# EAGLE design PowerTXBoard (EAGLE 7.5.0)
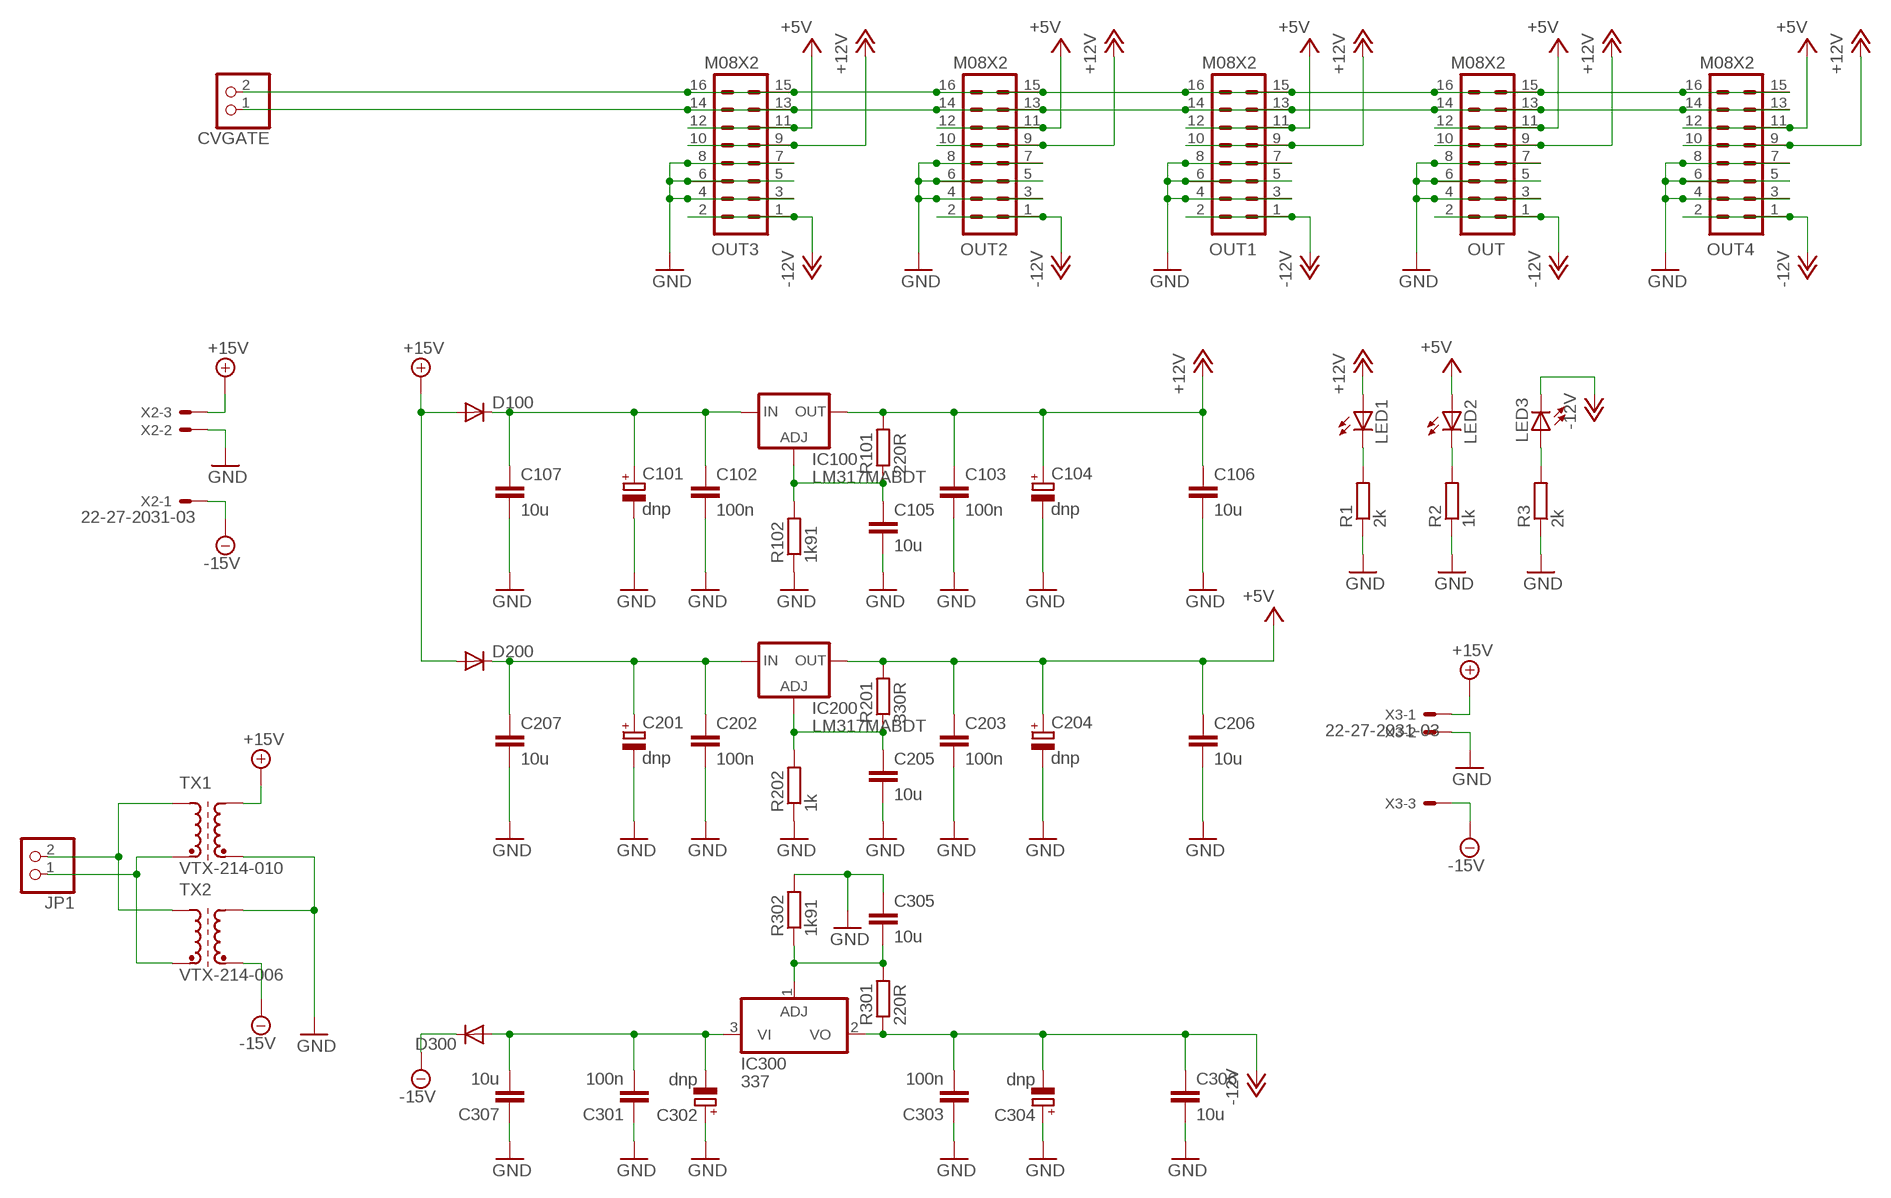
[diagram p0: schematic, sheet 1]

## Parts
C101  dnp  CPOL-EU153CLV-0505  [CPOL-5]
C102  100n  C-EUC0603  [C0603]
C103  100n  C-EUC0603  [C0603]
C104  dnp  CPOL-EU153CLV-0505  [CPOL-5]
C105  10u  C-EUC1206  [C1206]
C106  10u  C-EUC1206  [C1206]
C107  10u  C-EUC1206  [C1206]
C201  dnp  CPOL-EU153CLV-0505  [CPOL-5]
C202  100n  C-EUC0603  [C0603]
C203  100n  C-EUC0603  [C0603]
C204  dnp  CPOL-EU153CLV-0505  [CPOL-5]
C205  10u  C-EUC1206  [C1206]
C206  10u  C-EUC1206  [C1206]
C207  10u  C-EUC1206  [C1206]
C301  100n  C-EUC0603  [C0603]
C302  dnp  CPOL-EU153CLV-0505  [CPOL-5]
C303  100n  C-EUC0603  [C0603]
C304  dnp  CPOL-EU153CLV-0505  [CPOL-5]
C305  10u  C-EUC1206  [C1206]
C306  10u  C-EUC1206  [C1206]
C307  10u  C-EUC1206  [C1206]
CVGATE  PINHD-1X2  [1X02]
D100  DIODESMA  [SMA-DIODE]
D200  DIODESMA  [SMA-DIODE]
D300  DIODESMA  [SMA-DIODE]
IC100  LM317MABDT  [DPACK]
IC200  LM317MABDT  [DPACK]
IC300  337  [TO252]
JP1  PINHD-1X2  [1X02]
LED1  LEDCHIPLED_1206  [CHIPLED_1206]
LED2  LEDCHIPLED_1206  [CHIPLED_1206]
LED3  LEDCHIPLED_1206  [CHIPLED_1206]
OUT  M08X2  [2X8]
OUT1  M08X2  [2X8]
OUT2  M08X2  [2X8]
OUT3  M08X2  [2X8]
OUT4  M08X2  [2X8]
R1  2k  R-EU_0603  [0603]
R2  1k  R-EU_0603  [0603]
R3  2k  R-EU_0603  [0603]
R101  220R  R-EU_0603  [0603]
R102  1k91  R-EU_0603  [0603]
R201  330R  R-EU_0603  [0603]
R202  1k  R-EU_0603  [0603]
R301  220R  R-EU_0603  [0603]
R302  1k91  R-EU_0603  [0603]
TX1  VTX-214-010  VTX-214-006  [VTX-214-006]
TX2  VTX-214-006  [VTX-214-006]
X2  22-27-2031-03  [6410-03]
X3  22-27-2031-03  [6410-03]

## Nets
+5V: C203.1 C204.+ C206.1 IC200.4(OUT) LED2.A OUT1.11 OUT1.12 OUT2.11 OUT2.12 OUT3.11 OUT3.12 OUT4.11 OUT4.12 OUT.11 OUT.12 R201.2
+12V: C103.1 C104.+ C106.1 IC100.4(OUT) LED1.A OUT1.9 OUT1.10 OUT2.9 OUT2.10 OUT3.9 OUT3.10 OUT4.9 OUT4.10 OUT.9 OUT.10 R101.2
+15V: D100.A D200.A TX1.P$3(A2) X2.3 X3.1
-12V: C303.2 C304.- C306.1 IC300.2(VO) LED3.C OUT1.1 OUT1.2 OUT2.1 OUT2.2 OUT3.1 OUT3.2 OUT4.1 OUT4.2 OUT.1 OUT.2 R301.1
-15V: D300.C TX2.P$4(E2) X2.1 X3.3
GND: C101.- C102.2 C103.2 C104.- C105.2 C106.2 C107.2 C201.- C202.2 C203.2 C204.- C205.2 C206.2 C207.2 C301.1 C302.+ C303.1 C304.+ C305.1 C306.2 C307.1 OUT1.3 OUT1.4 OUT1.5 OUT1.6 OUT1.7 OUT1.8 OUT2.3 OUT2.4 OUT2.5 OUT2.6 OUT2.7 OUT2.8 OUT3.3 OUT3.4 OUT3.5 OUT3.6 OUT3.7 OUT3.8 OUT4.3 OUT4.4 OUT4.5 OUT4.6 OUT4.7 OUT4.8 OUT.3 OUT.4 OUT.5 OUT.6 OUT.7 OUT.8 R1.1 R2.1 R3.1 R102.1 R202.1 R302.2 TX1.P$4(E2) TX2.P$3(A2) X2.2 X3.2
N$1: LED1.C R1.2
N$2: LED2.C R2.2
N$3: C105.1 IC100.1(ADJ) R101.1 R102.2
N$4: C205.1 IC200.1(ADJ) R201.1 R202.2
N$5: C305.2 IC300.1(ADJ) R301.2 R302.1
N$6: C301.2 C302.- C307.2 D300.A IC300.3(VI)
N$7: C201.+ C202.1 C207.1 D200.C IC200.3(IN)
N$8: C101.+ C102.1 C107.1 D100.C IC100.3(IN)
N$9: LED3.A R3.2
N$10: CVGATE.1 OUT1.13 OUT1.14 OUT2.13 OUT2.14 OUT3.13 OUT3.14 OUT4.13 OUT4.14 OUT.13 OUT.14
N$11: JP1.2 TX1.P$1(A1) TX2.P$1(A1)
N$12: CVGATE.2 OUT1.15 OUT1.16 OUT2.15 OUT2.16 OUT3.15 OUT3.16 OUT4.15 OUT4.16 OUT.15 OUT.16
N$13: JP1.1 TX1.P$2(E1) TX2.P$2(E1)

## Library data of the parts
C101 C104 C201 C204 C302 C304 = Rebel:CPOL-EU: POLARIZED CAPACITOR, European symbol
C102 C103 C105-C107 C202 C203 C205-C207 C301 C303 C305-C307 = rcl:C-EU: CAPACITOR, European symbol
CVGATE JP1 = pinhead:PINHD-1X2: PIN HEADER
D100 D200 D300 = SparkFun:DIODE: Diode These are standard reverse protection diodes and small signal diodes. SMA package can handle up to about 1A. SOD-323 can handle about 200mA. What the SOD-323 package when ordering, there are some mfgs out there that are 5-pin packages.
IC100 IC200 = v-reg:LM317?*: 500 mA Adjustable Output Positive Voltage Regulator Source: http://www.onsemi.co.jp .. LM317M-D.PDF
IC300 = linear:*337: Negative VOLTAGE REGULATOR
LED1-LED3 = led:LED: LED OSRAM: - CHIPLED LG R971, LG N971, LY N971, LG Q971, LY Q971, LO R971, LY R971 LH N974, LH R974 LS Q976, LO Q976, LY Q976 LO Q996 - Hyper CHIPLED LW Q18S LB Q993, LB Q99A, LB R99A - SideLED LS A670, LO A670, LY A670, LG A670, LP A670 LB A673, LV A673, LT A673, LW A673 LH A674 LY A675 LS A676, LA A676, LO A676, LY A676, LW A676 LS A679, LY A679, LG A679 - Hyper Micro SIDELED® LS Y876, LA Y876, LO Y876, LY Y876 LT Y87S - SmartLED LW L88C, LW L88S LB L89C, LB L89S, LG L890 LS L89K, LO L89K, LY L89K LS L896, LA L896, LO L896, LY L896 - TOPLED LS T670, LO T670, LY T670, LG T670, LP T670 LSG T670, LSP T670, LSY T670, LOP T670, LYG T670 LG T671, LOG T671, LSG T671 LB T673, LV T673, LT T673, LW T673 LH T674 LS T676, LA T676, LO T676, LY T676, LB T676, LH T676, LSB T676, LW T676 LB T67C, LV T67C, LT T67C, LS T67K, LO T67K, LY T67K, LW E67C LS E67B, LA E67B, LO E67B, LY E67B, LB E67C, LV E67C, LT E67C LW T67C LS T679, LY T679, LG T679 LS T770, LO T770, LY T770, LG T770, LP T770 LB T773, LV T773, LT T773, LW T773 LH T774 LS E675, LA E675, LY E675, LS T675 LS T776, LA T776, LO T776, LY T776, LB T776 LHGB T686 LT T68C, LB T68C - Hyper Mini TOPLED® LB M676 - Mini TOPLED Santana® LG M470 LS M47K, LO M47K, LY M47K Source: http://www.osram.convergy.de LUXEON: - LUMILED® LXK2-PW12-R00, LXK2-PW12-S00, LXK2-PW14-U00, LXK2-PW14-V00 LXK2-PM12-R00, LXK2-PM12-S00, LXK2-PM14-U00 LXK2-PE12-Q00, LXK2-PE12-R00, LXK2-PE12-S00, LXK2-PE14-T00, LXK2-PE14-U00 LXK2-PB12-K00, LXK2-PB12-L00, LXK2-PB12-M00, LXK2-PB14-N00, LXK2-PB14-P00, LXK2-PB14-Q00 LXK2-PR12-L00, LXK2-PR12-M00, LXK2-PR14-Q00, LXK2-PR14-R00 LXK2-PD12-Q00, LXK2-PD12-R00, LXK2-PD12-S00 LXK2-PH12-R00, LXK2-PH12-S00 LXK2-PL12-P00, LXK2-PL12-Q00, LXK2-PL12-R00 Source: www.luxeon.com KINGBRIGHT: KA-3528ASYC Source: www.kingbright.com
OUT OUT1-OUT4 = SparkFun:M08X2
R1-R3 R101 R102 R201 R202 R301 R302 = Rebel:R-EU_: RESISTOR, European symbol
TX1 TX2 = Rebel:VTX-214-006
X2 X3 = con-molex:22-?-03: CONNECTOR wire to board 2.54 mm (.1 inch) pitch header; OC_FARNELL: unknown; OC_NEWARK: unknown

## Board
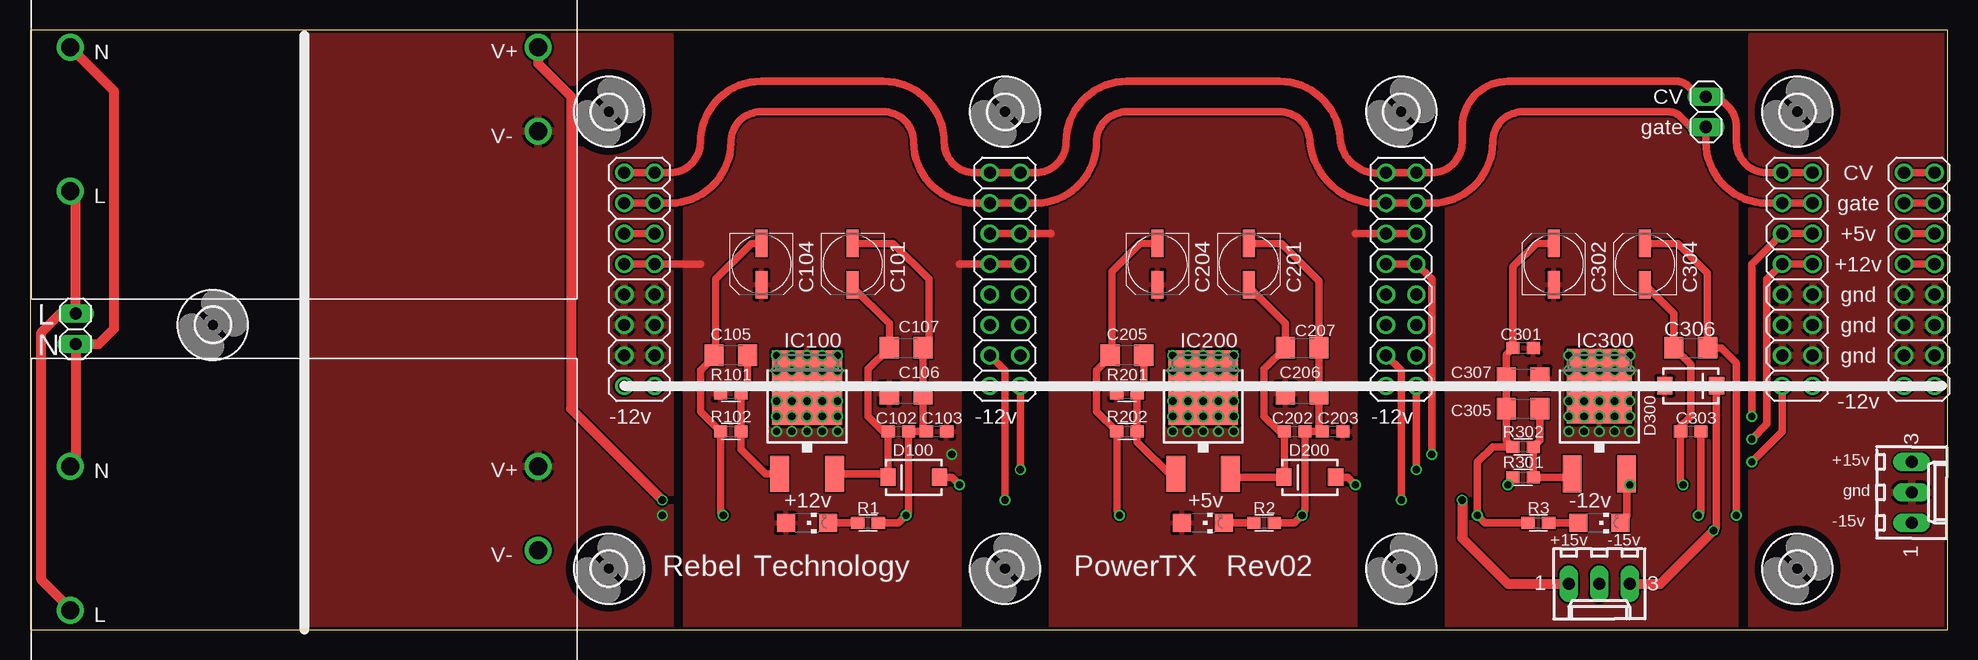
[diagram p1: board, top side]
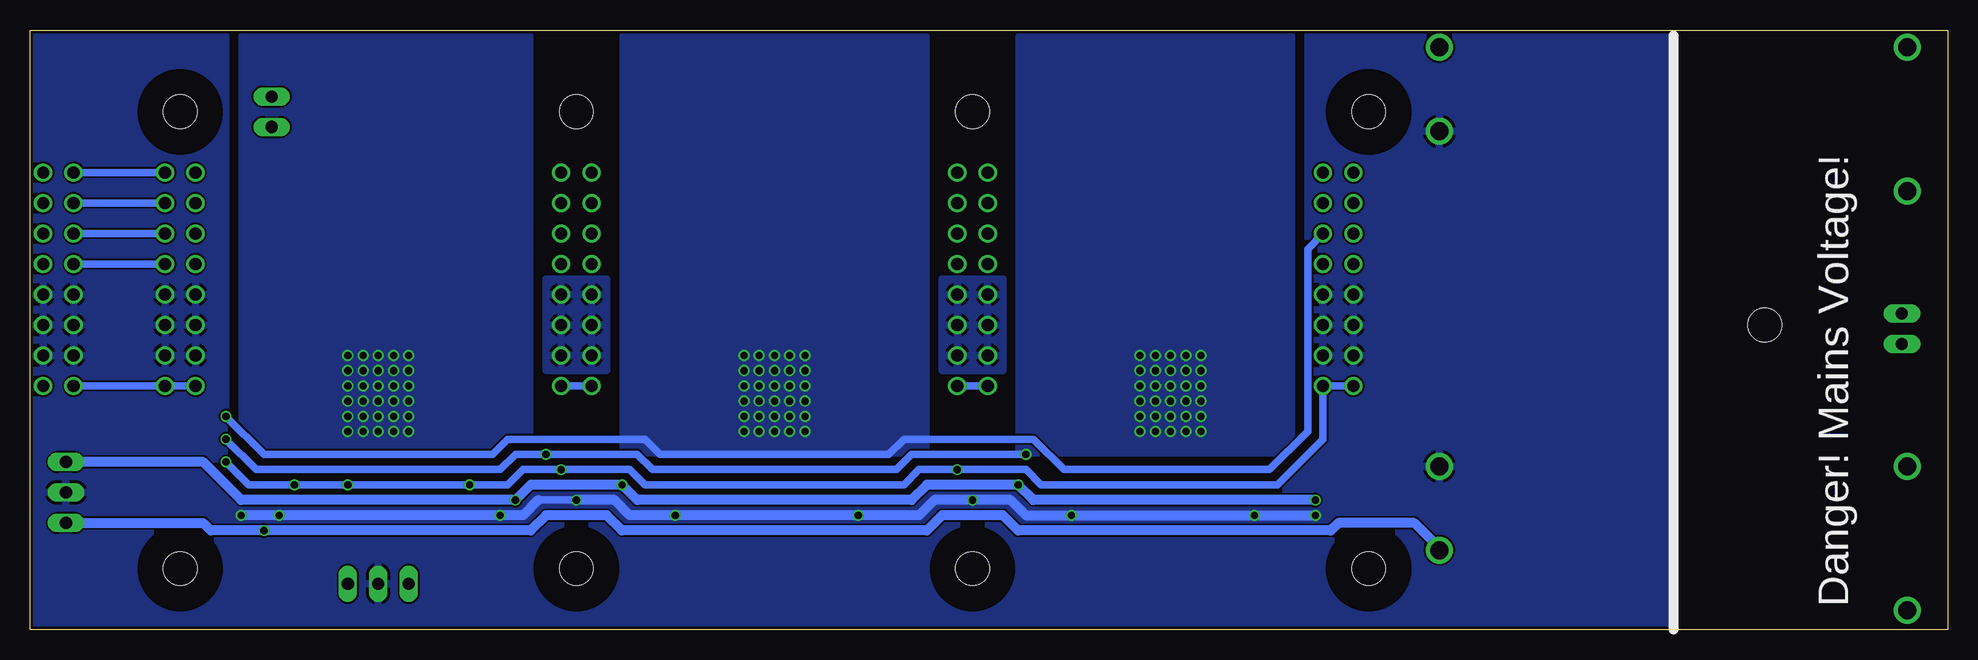
[diagram p2: board, bottom side, seen from below]

Size 159.84 x 50 mm. Coordinates in mm from the lower left corner, seen from the top.
Outline: 0,0 159.84,0 159.84,50 0,50 0,0
Copper layers (1*16): Top 0.035mm / dielectric 1.5mm / Bottom 0.035mm
Design rules "SeeedStudio_2layer_DRU_no_angle_20140221": minimum track width 6mil, minimum drill 12mil, track to track 6mil, track to pad 6mil, pad to pad 6mil, via to via 6mil, smd to smd 0mil, copper to edge 10mil, drill to drill 10mil, minimum pad ring 10mil, minimum via ring 6mil, stop-mask expansion 2mil, vias tented up to drill 100mil, thermal gap 10mil

### Footprints (pad centres in the part's own frame; a part is rotated, then mirrored left to right if it is on the bottom)
CPOL-5 = smd 2.3 x 1: + 1.725,0; - -1.725,0
C0603 = smd 1.1 x 1: 1 -0.85,0; 2 0.85,0
C1206 = smd 1.6 x 1.8: 1 -1.4,0; 2 1.4,0
1X02 = drill 1.016 long: 1 -1.27,0; 2 1.27,0
SMA-DIODE = smd 1.27 x 1.47: A -2.15,0; C 2.15,0
DPACK = smd 1.6 x 3: 1 -2.28,-4.8; 3 2.28,-4.8 | smd 5.8 x 6.2: 4 0,2.38
TO252 = smd 1.524 x 3.048: 1 -2.28,-4.8; 2 2.28,-4.8 | smd 5.4 x 6.2: 3 0,2.5
CHIPLED_1206 = smd 1.5 x 1.5: A 0,-1.75; C 0,1.75
2X8 = drill 1.016: 1 0,0; 2 0,2.54; 3 2.54,0; 4 2.54,2.54; 5 5.08,0; 6 5.08,2.54; 7 7.62,0; 8 7.62,2.54; 9 10.16,0; 10 10.16,2.54; 11 12.7,0; 12 12.7,2.54; 13 15.24,0; 14 15.24,2.54; 15 17.78,0; 16 17.78,2.54
0603 = smd 1.1 x 1: 1 -0.85,0; 2 0.85,0
VTX-214-006 = drill 1.5: P$1 -19.5,-6; P$2 -19.5,6; P$3 19.5,6; P$4 19.5,-1
2,8 = hole 2.8: 0,0
6410-03 = drill 1.016 long: 1 2.54,0; 2 0,0; 3 -2.54,0

### Placement (x,y rotation side)
C101  68.58,30.48 270 top
C102  72.39,16.51 0 top
C103  75.56,16.51 180 top
C104  60.96,30.48 270 top
C105  58.42,22.86 180 top
C106  73.03,19.68 0 top
C107  73.03,23.5 0 top
C201  101.6,30.48 270 top
C202  105.41,16.51 0 top
C203  108.59,16.51 180 top
C204  93.98,30.48 270 top
C205  91.44,22.86 180 top
C206  106.05,19.68 0 top
C207  106.05,23.5 0 top
C301  124.46,23.5 0 top
C302  127,30.48 90 top
C303  138.43,16.51 180 top
C304  134.62,30.48 90 top
C305  124.46,18.41 0 top
C306  138.43,23.5 0 top
C307  124.46,20.95 0 top
CVGATE  139.7,43.18 90 top
D100  73.66,12.7 180 top
D200  106.68,12.7 180 top
D300  138.43,20.32 0 top
IC100  64.77,17.78 0 top
IC200  97.79,17.78 0 top
IC300  130.81,17.78 0 top
JP1  3.81,25.08 90 top
LED1  64.77,8.89 270 top
LED2  97.79,8.89 270 top
LED3  130.81,8.89 270 top
OUT  52.07,20.32 90 top
OUT1  82.55,20.32 90 top
OUT2  115.57,20.32 90 top
OUT3  148.59,20.32 90 top
OUT4  158.75,20.32 90 top
R1  69.85,8.89 180 top
R2  102.87,8.89 180 top
R3  125.73,8.89 0 top
R101  58.42,19.68 180 top
R102  58.42,16.51 0 top
R201  91.44,19.68 180 top
R202  91.44,16.51 0 top
R301  124.46,12.7 0 top
R302  124.46,15.24 180 top
TX1  22.86,42.55 0 top
TX2  22.86,7.62 0 top
U$1  [2,8]  81.28,5.08 0 top
U$2  [2,8]  147.32,5.08 0 top
U$3  [2,8]  81.28,43.18 0 top
U$4  [2,8]  147.32,43.18 0 top
U$5  [2,8]  48.26,43.18 0 top
U$6  [2,8]  48.26,5.08 0 top
U$7  [2,8]  114.3,43.18 0 top
U$8  [2,8]  114.3,5.08 0 top
U$11  [2,8]  15.24,25.4 0 top
X2  156.84,11.43 270 top
X3  130.81,3.81 180 top

### Tracks (layer width: path | path; a pad name or v marks a point on that pad's centre or on a via)
+5V  (via drill 0.6)
  Top 0.61: 110.49,33.02 OUT2.12 OUT2.11 | OUT.12 OUT.11 | OUT1.12 OUT1.11 85.09,33.02 | OUT3.11 OUT3.12 143.51,30.48 v143.51,17.78 | OUT4.12 OUT4.11
  Bottom 0.61: OUT.11 53.34,31.75 53.34,16.51 56.52,13.34 73.66,13.34 76.2,15.88 87,15.88 88.27,14.61 107.31,14.61 108.59,15.88 120.02,15.88 121.28,14.61 140.34,14.61 v143.51,17.78 | OUT3.11 OUT4.12
  other vias: 95.25,22.86 96.52,22.86 95.25,21.59 96.52,21.59 95.25,20.32 96.52,20.32 97.79,22.86 97.79,21.59 97.79,20.32 99.06,22.86 100.33,22.86 99.06,21.59 100.33,21.59 99.06,20.32 100.33,20.32 100.33,19.05 99.06,19.05 99.06,17.78 100.33,17.78 97.79,19.05 97.79,17.78 96.52,19.05 95.25,19.05 95.25,17.78 95.25,16.51 96.52,17.78 96.52,16.51 97.79,16.51 99.06,16.51 100.33,16.51
  pour Bottom: 85.09,49.53 85.09,14.61 110.49,14.61 110.49,49.53
  pour Top: 85.09,49.53 85.09,0 110.49,0 110.49,49.53
+12V  (via drill 0.6)
  Top 0.61: v116.84,14.61 116.84,29.21 OUT2.9 OUT2.10 | v143.51,15.88 144.78,17.14 144.78,29.21 OUT3.10 OUT3.9 | 77.47,30.48 OUT1.10 OUT1.9 | OUT.10 OUT.9 55.88,30.48 | OUT4.10 OUT4.9
  Bottom 0.61: v76.84,14.61 86.36,14.61 87.63,13.34 107.95,13.34 109.22,14.61 v116.84,14.61 119.38,14.61 120.65,13.34 140.97,13.34 v143.51,15.88 | OUT3.9 OUT4.10
  other vias: 62.23,22.86 63.5,22.86 62.23,21.59 64.77,22.86 66.04,22.86 67.31,22.86 67.31,21.59 66.04,21.59 64.77,21.59 63.5,21.59 62.23,20.32 62.23,19.05 62.23,17.78 62.23,16.51 63.5,20.32 64.77,20.32 66.04,20.32 67.31,20.32 67.31,19.05 66.04,19.05 64.77,19.05 63.5,19.05 63.5,17.78 63.5,16.51 64.77,16.51 64.77,17.78 66.04,17.78 66.04,16.51 67.31,17.78 67.31,16.51
  pour Bottom: 54.61,49.53 54.61,14.61 77.47,14.61 77.47,49.53
  pour Top: 54.61,49.53 54.61,0 77.47,0 77.47,49.53
+15V  (via drill 0.6)
  Top 0.61: D100.A 76.84,12.7 v77.47,12.06 | D200.A 109.86,12.7 v110.49,12.06
  Top 0.813: v119.38,10.79 119.38,7.62 123.19,3.81 X3.1 | TX1.P$3 42.36,47.17 45.09,44.45 45.09,18.41 v52.7,10.79
  Bottom 0.813: v52.7,10.79 76.2,10.79 v77.47,12.06 85.09,12.06 86.36,10.79 109.22,10.79 v110.49,12.06 118.11,12.06 v119.38,10.79 142.24,10.79 145.41,13.97 X2.3
-12V  (via drill 0.6)
  Top 0.61: v143.51,13.97 146.05,16.51 OUT3.2 | v137.79,12.06 137.58,12.28 C303.2 137.58,16.93 138.43,17.78 138.43,22.09 C306.1 137.03,26.34 C304.- | LED3.C 133.09,9.42 IC300.2 133.09,12.32 v133.35,12.06 | OUT2.1 v115.57,13.34 | R301.1 123.61,12.48 v123.19,12.06 | OUT1.1 v82.55,13.34 | OUT4.2 OUT4.1
  Bottom 0.61: OUT2.1 OUT2.2 | OUT1.1 OUT1.2 | OUT3.2 OUT3.1 OUT4.2 | OUT.2 OUT.1 52.07,15.88 55.88,12.06 75.56,12.06 76.84,13.34 v82.55,13.34 85.72,13.34 87,12.06 108.59,12.06 109.86,13.34 v115.57,13.34 118.75,13.34 120.02,12.06 v123.19,12.06 v133.35,12.06 v137.79,12.06 141.6,12.06 v143.51,13.97
-15V  (via drill 0.6)
  Top 0.61: D300.C 140.58,8.5 v140.34,8.26
  Top 0.813: X3.3 135.89,3.81 v140.34,8.26
  Bottom 0.813: X2.1 145.41,8.89 144.78,8.26 v140.34,8.26 118.11,8.26 116.84,9.53 111.76,9.53 110.49,8.26 85.09,8.26 83.82,9.53 78.74,9.53 77.47,8.26 51.44,8.26 50.8,8.89 44.45,8.89 42.36,6.8 TX2.P$4
GND  (via drill 0.6)
  Top 0.61: OUT2.4 114.3,21.59 v114.3,10.79 | v57.79,9.53 57.57,9.74 R102.1 55.88,18.2 55.88,21.59 57.02,22.73 C105.2 57.15,22.99 57.15,29.21 60.15,32.2 C104.- | OUT1.4 81.28,21.59 v81.28,10.79 | v90.81,9.53 90.59,9.95 R202.1 88.9,18.2 88.9,21.59 90.17,22.86 | C303.1 139.28,9.74 v139.06,9.53 | v142.24,9.53 142.24,22.23 140.97,23.5 C306.2 | 139.7,23.62 C306.2 | R1.1 72.39,8.89 v73.03,9.53 73.24,9.74 C102.2 C103.2 74.42,16.8 C106.2 C107.2 74.93,24 74.93,29.21 71.94,32.2 C101.- | R2.1 105.41,8.89 v106.05,9.53 106.26,9.95 C202.2 C203.2 107.45,16.8 C206.2 C207.2 107.45,29.08 104.32,32.2 C201.- | R3.1 121.28,8.89 v120.65,9.53 120.65,13.97 121.92,15.24 R302.2 123.06,15.79 C305.1 C307.1 123.06,22.95 C301.1 123.61,30.27 125.55,32.2 C302.+ | C205.2 90.17,22.86 | C304.+ 137.34,32.2 139.83,29.71 C306.2 | 90.17,22.86 90.17,29.84 92.53,32.2 C204.-
  Bottom 0.61: v114.3,10.79 117.47,10.79
  Bottom 0.813: v114.3,10.79 111.12,10.79 109.86,9.53 v106.05,9.53 v90.81,9.53 85.72,9.53 84.45,10.79 v81.28,10.79 78.11,10.79 76.84,9.53 v73.03,9.53 v57.79,9.53 v52.7,9.53 | 117.47,10.79 118.75,9.53 v120.65,9.53 v139.06,9.53 v142.24,9.53
  pour Bottom: 22.86,13.34 22.86,0 143.51,0 143.51,13.34
  pour Bottom: 22.86,49.53 22.86,0 53.34,0 53.34,49.53
  pour Bottom: 143.51,49.53 143.51,0 161.93,0 161.93,49.53
  pour Bottom: 111.76,29.21 116.84,29.21 116.84,21.59 111.76,21.59
  pour Bottom: 78.74,29.21 83.82,29.21 83.82,21.59 78.74,21.59
  pour Top: 22.86,49.53 22.86,0 53.34,0 53.34,49.53
  pour Top: 143.51,49.53 143.51,0 161.93,0 161.93,49.53
N$1
  Top 0.61: R1.2 LED1.C
N$2
  Top 0.61: R2.2 LED2.C
N$3
  Top 0.61: IC100.1 61.31,12.98 59.27,15.03 R102.2 R101.1 59.82,20.23 C105.1
N$4
  Top 0.61: IC200.1 95.51,12.96 95.25,12.7 92.29,15.66 R202.2 R201.1 92.84,20.23 C205.1
N$5
  Top 0.61: IC300.1 128.25,12.7 R301.2 R302.1 125.86,15.79 C305.2
N$6  (via drill 0.6)
  other vias: 128.27,22.86 129.54,22.86 130.81,22.86 132.08,22.86 133.35,22.86 133.35,21.59 132.08,21.59 130.81,21.59 129.54,21.59 128.27,21.59 128.27,20.32 128.27,19.05 128.27,17.78 128.27,16.51 129.54,20.32 129.54,19.05 129.54,17.78 129.54,16.51 130.81,20.32 130.81,19.05 130.81,17.78 132.08,20.32 133.35,20.32 132.08,19.05 133.35,19.05 133.35,17.78 132.08,17.78 130.81,16.51 132.08,16.51 133.35,16.51
  pour Bottom: 118.11,49.53 118.11,14.61 142.24,14.61 142.24,49.53
  pour Top: 118.11,49.53 118.11,0 142.24,0 142.24,49.53
N$7
  Top 0.61: IC200.3 100.35,12.7 D200.C 104.56,12.73 C202.1 104.14,16.51 102.87,17.78 102.87,21.72 C207.1 104.64,25.53 101.6,28.57 C201.+
N$8
  Top 0.61: IC100.3 71.23,12.98 D100.C 71.54,12.73 C102.1 71.12,16.51 69.85,17.78 69.85,21.72 C107.1 71.62,25.53 68.58,28.57 C101.+
N$9
  Top 0.61: R3.2 LED3.A
N$10
  Top 0.61: OUT.14 OUT.13 53.34,35.56 arc90 58.42,40.64 arc-90 60.96,43.18 71.12,43.18 arc-90 73.66,40.64 arc90 78.74,35.56 OUT1.14 OUT1.13 83.82,35.56 arc90 88.9,40.64 arc-90 91.44,43.18 104.14,43.18 arc-90 106.68,40.64 arc90 OUT2.14 OUT2.13 116.84,35.56 arc90 121.92,40.64 arc-90 124.46,43.18 136.57,43.18 arc-45 137.58,42.76 138.43,41.91 CVGATE.1 139.7,40.64 arc90 144.78,35.56 OUT3.14 OUT3.13 | OUT4.14 OUT4.13
  Bottom 0.61: OUT3.13 OUT4.14
N$11
  Top 0.813: TX2.P$1 3.36,1.72 0.95,4.13 0.95,24.77 2.54,26.35 JP1.2 3.81,36.09 TX1.P$1
N$12
  Top 0.61: OUT.16 OUT.15 53.34,38.1 arc90 55.88,40.64 arc-90 60.96,45.72 71.12,45.72 arc-90 76.2,40.64 arc90 78.74,38.1 OUT1.16 OUT1.15 83.82,38.1 arc90 86.36,40.64 arc-90 91.44,45.72 104.14,45.72 arc-90 109.22,40.64 arc90 OUT2.16 OUT2.15 116.84,38.1 arc90 119.38,40.64 119.38,41.91 arc-90 123.19,45.72 137.27,45.72 arc-45 138.17,45.35 139.06,44.45 CVGATE.2 arc-90 142.24,41.91 142.24,40.64 arc90 144.78,38.1 OUT3.16 OUT3.15 | OUT4.16 OUT4.15
  Bottom 0.61: OUT3.15 OUT4.16
N$13
  Top 0.813: TX2.P$2 3.81,14.07 JP1.1 5.71,23.81 6.99,25.08 6.99,44.92 TX1.P$2

### Text on the board
tPlace: CV | gate | CV | gate | +5v | +12v | gnd | L | gnd | N | gnd | -12v | -12v | -12v | -12v | +15v | gnd | +12v | +5v | -12v | -15v | +15v | -15v | Rebel | Technology | PowerTX | Rev02
bPlace: Danger! Mains Voltage!